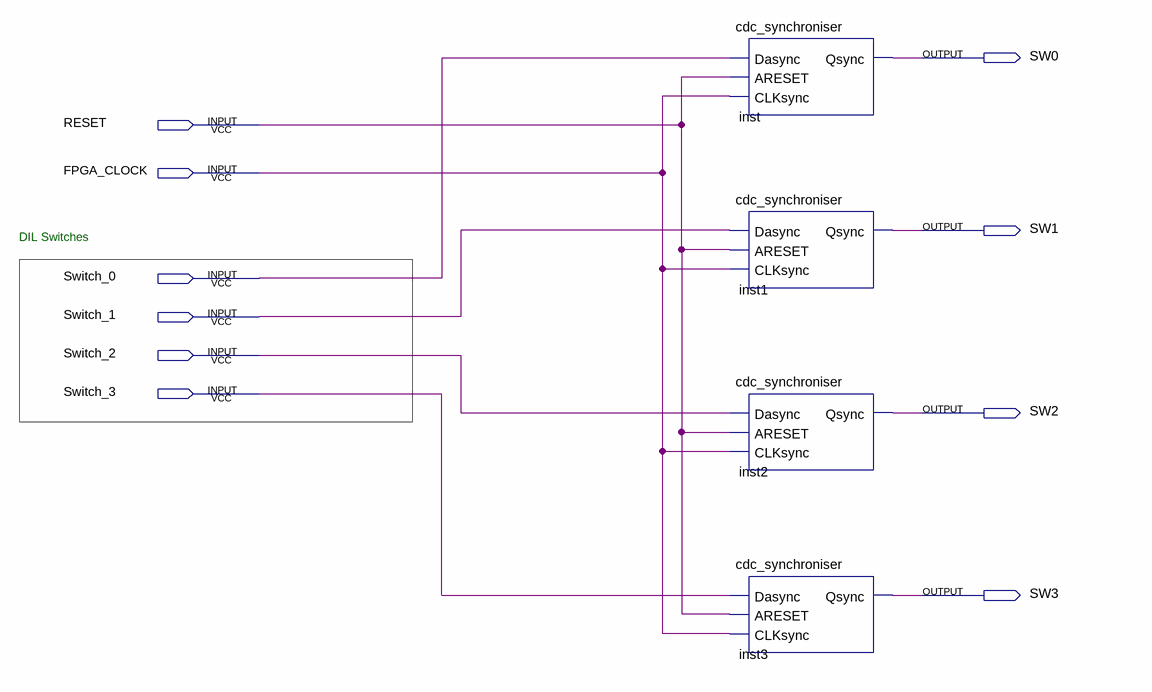
[diagram p0: schematic sheet]
// Quartus schematic switches.bdf as structural Verilog: 4 symbols, 10 pins
module switches (
  input  RESET,
  input  FPGA_CLOCK,
  input  Switch_0,
  input  Switch_1,
  input  Switch_2,
  input  Switch_3,
  output SW0,
  output SW1,
  output SW2,
  output SW3
);

  cdc_synchroniser inst (.Dasync(Switch_0), .ARESET(RESET), .CLKsync(FPGA_CLOCK), .Qsync(SW0));
  cdc_synchroniser inst1 (.Dasync(Switch_1), .ARESET(RESET), .CLKsync(FPGA_CLOCK), .Qsync(SW1));
  cdc_synchroniser inst2 (.Dasync(Switch_2), .ARESET(RESET), .CLKsync(FPGA_CLOCK), .Qsync(SW2));
  cdc_synchroniser inst3 (.Dasync(Switch_3), .ARESET(RESET), .CLKsync(FPGA_CLOCK), .Qsync(SW3));

  // Notes on the sheet:
  //   DIL Switches
endmodule
